# EAGLE design at88g.v2 (EAGLE 4.11)
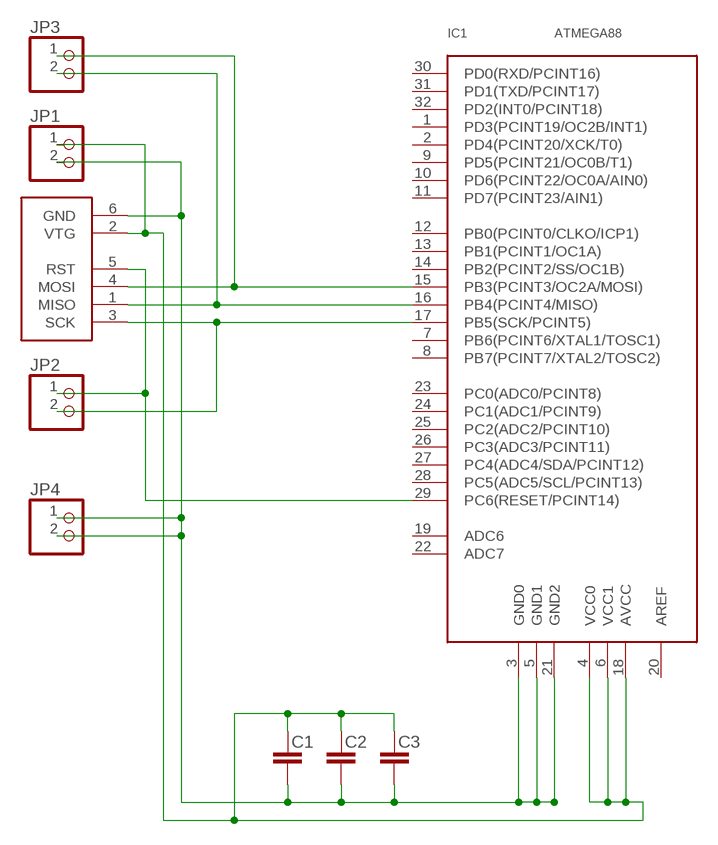
[diagram p0: schematic, sheet 1]

## Parts
C1  C-EU  [C0603]
C2  C-EU  [C0603]
C3  C-EU  [C0603]
IC1  ATMEGA88  [TQFP32]
JP1  PINHD-1X2  [1X02]
JP2  PINHD-1X2  [1X02]
JP3  PINHD-1X2  [1X02]
JP4  PINHD-1X2  [1X02]
X1  AVRISP6PIN  [6PIN]

## Nets
GND0: C1.2 C2.2 C3.2 IC1.3(GND0) IC1.5(GND1) IC1.21(GND2) JP1.2 JP4.1 JP4.2 X1.6(GND)
N$1: IC1.29(PC6(RESET/PCINT14)) JP2.1 X1.5(RST)
N$2: IC1.15(PB3(PCINT3/OC2A/MOSI)) JP3.1 X1.4(MOSI)
N$3: IC1.16(PB4(PCINT4/MISO)) JP3.2 X1.1(MISO)
N$4: IC1.17(PB5(SCK/PCINT5)) JP2.2 X1.3(SCK)
VCC0: C1.1 C2.1 C3.1 IC1.4(VCC0) IC1.6(VCC1) IC1.18(AVCC) JP1.1 X1.2(VTG)
Unconnected: IC1.1(PD3(PCINT19/OC2B/INT1)) IC1.2(PD4(PCINT20/XCK/T0)) IC1.7(PB6(PCINT6/XTAL1/TOSC1)) IC1.8(PB7(PCINT7/XTAL2/TOSC2)) IC1.9(PD5(PCINT21/OC0B/T1)) IC1.10(PD6(PCINT22/OC0A/AIN0)) IC1.11(PD7(PCINT23/AIN1)) IC1.12(PB0(PCINT0/CLKO/ICP1)) IC1.13(PB1(PCINT1/OC1A)) IC1.14(PB2(PCINT2/SS/OC1B)) IC1.19(ADC6) IC1.20(AREF) IC1.22(ADC7) IC1.23(PC0(ADC0/PCINT8)) IC1.24(PC1(ADC1/PCINT9)) IC1.25(PC2(ADC2/PCINT10)) IC1.26(PC3(ADC3/PCINT11)) IC1.27(PC4(ADC4/SDA/PCINT12)) IC1.28(PC5(ADC5/SCL/PCINT13)) IC1.30(PD0(RXD/PCINT16)) IC1.31(PD1(TXD/PCINT17)) IC1.32(PD2(INT0/PCINT18))

## Library data of the parts
C1-C3 = rcl:C-EU
IC1 = atmega88:ATMEGA88
JP1-JP4 = pinhead-mm:PINHD-1X2: PIN HEADER
X1 = avrisp:AVRISP6PIN

## Board
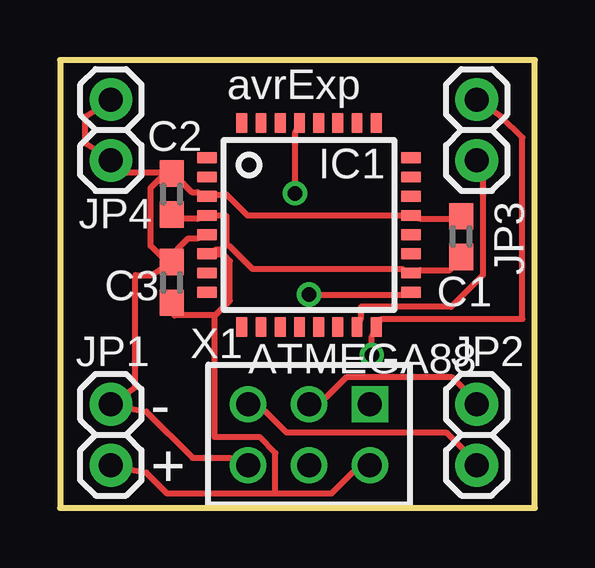
[diagram p1: board, top side]
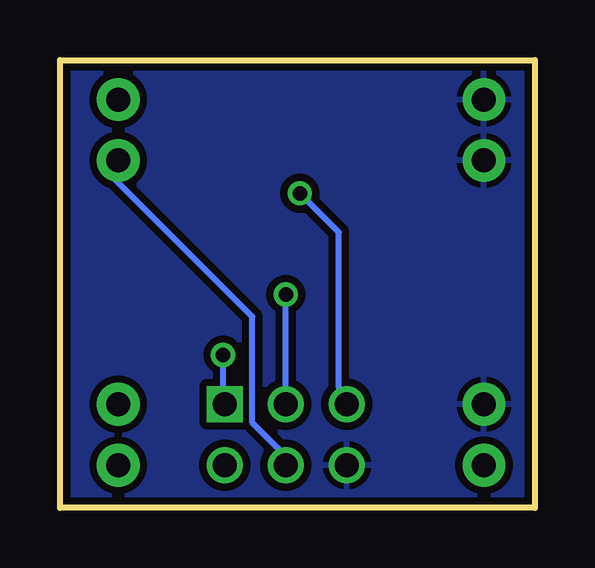
[diagram p2: board, bottom side, seen from below]

Size 19.79 x 18.66 mm. Coordinates in mm from the lower left corner, seen from the top.
Outline: 0,0 19.79,0 19.79,18.66 0,18.66 0,0
Copper layers (1*16): Top 0.035mm / dielectric 1.5mm / Bottom 0.035mm
Design rules "default": minimum track width 10mil, minimum drill 0.6mm, track to track 10mil, track to pad 10mil, pad to pad 10mil, via to via 10mil, smd to smd 10mil, copper to edge 10mil, drill to drill 10mil, minimum pad ring 10mil, minimum via ring 8mil, stop-mask expansion 4mil, vias tented up to drill 0mil, thermal gap 10mil

### Footprints (pad centres in the part's own frame; a part is rotated, then mirrored left to right if it is on the bottom)
C0603 = smd 1.1 x 1: 1 -0.85,0; 2 0.85,0
TQFP32 = smd 0.8 x 0.45: 1 -4.25,2.65; 2 -4.25,1.85; 3 -4.25,1.05; 4 -4.25,0.25; 5 -4.25,-0.55; 6 -4.25,-1.35; 7 -4.25,-2.15; 8 -4.25,-2.95; 17 4.25,-2.95; 18 4.25,-2.15; 19 4.25,-1.35; 20 4.25,-0.55; 21 4.25,0.25; 22 4.25,1.05; 23 4.25,1.85; 24 4.25,2.65 | smd 0.45 x 0.8: 9 -2.8,-4.4; 10 -2,-4.4; 11 -1.2,-4.4; 12 -0.4,-4.4; 13 0.4,-4.4; 14 1.2,-4.4; 15 2,-4.4; 16 2.8,-4.4; 25 2.8,4.1; 26 2,4.1; 27 1.2,4.1; 28 0.4,4.1; 29 -0.4,4.1; 30 -1.2,4.1; 31 -2,4.1; 32 -2.8,4.1
1X02 = drill 1 pad 1.778 round: 1 -1.27,0; 2 1.27,0
6PIN = drill 1 square: 1 -1.27,2.54 | drill 1 round: 2 1.27,2.54; 3 -1.27,0; 4 1.27,0; 5 -1.27,-2.54; 6 1.27,-2.54

### Placement (x,y rotation side)
C1  16.73,11.3 90 top
C2  4.66,13.08 90 top
C3  4.66,9.39 90 top
IC1  10.38,11.93 0 top
JP1  2.12,3.04 90 top
JP2  17.36,3.04 90 top
JP3  17.36,15.74 90 top
JP4  2.12,15.74 90 top
X1  10.38,3.04 270 top

### Tracks (layer width: path | path; a pad name or v marks a point on that pad's centre or on a via)
GND0
  Top 0.254: X1.6 7.1,2.08 5.53,2.08 3.59,4.01 JP1.2 3.14,5.02 3.14,9.7 3.8,9.7 C3.2 | JP4.2 1.05,16.3 1.05,15.18 JP4.1 2.64,13.96 4.41,13.96 | IC1.5 5.73,11.22 5.35,11.22 4.89,10.77 C3.2 | C1.2 16.24,12.03 15.02,12.03 IC1.21 14.26,12.19 7.81,12.19 6.95,13.05 6.24,13.05 IC1.3 5.73,13.15 5.5,13.15 5.14,13.51 C2.2 4.41,13.96 | C3.2 4.45,10.24 3.77,10.92 3.77,13.33 4.41,13.96 | 4.41,13.96 4.41,13.97 | 4.41,13.96
  pour Bottom (isolate 0.305): -0.16,18.79 19.9,18.79 19.9,-0.13 -0.16,-0.13
N$1  (via drill 0.6)
  Top 0.254: v9.79,13.1 9.79,15.64 IC1.29 | JP2.1 17.16,2.08 16.09,3.14 9.44,3.14 8.57,4.01 X1.5
  Bottom 0.254: v9.79,13.1 8.17,11.48 8.17,5.02 X1.5
N$2
  Top 0.254: IC1.15 12.54,7.92 12.54,8.38 16.29,8.38 17.61,9.7 17.61,13.76 JP3.1
  Bottom 0.254: X1.4 10.71,2.48 11.77,3.55 11.77,7.97 17.56,13.76 JP3.1
N$3  (via drill 0.6)
  Top 0.254: v12.99,6.37 12.99,7.16 IC1.16 13.4,7.87 19.27,7.87 19.27,15.44 18.38,16.3 JP3.2
  Bottom 0.254: v12.99,6.37 12.99,5.02 X1.1
N$4  (via drill 0.6)
  Top 0.254: IC1.17 14.26,8.89 v10.38,8.89 | JP2.2 17.16,4.62 16.32,5.46 11.95,5.46 11.11,4.62 X1.3
  Bottom 0.254: X1.3 v10.38,8.89
VCC0
  Top 0.254: C1.1 16.24,9.9 15.02,9.9 IC1.18 14.26,9.95 8.01,9.95 7.05,10.92 6.95,10.97 | 6.95,10.97 6.74,10.77 6.49,10.77 IC1.6 6.19,10.54 6.82,10.54 7.07,10.28 7.07,8.63 6.44,8 | 6.95,10.97 6.95,12.16 6.49,12.16 IC1.4 5.73,12.03 4.51,12.03 C2.1 | 4.64,8.58 C3.1 4.76,8.02 6.44,8.02 6.44,8 | 8.98,0.6 11.32,0.6 12.18,1.47 X1.2 | 8.98,0.6 4.46,0.6 3.59,1.47 JP1.1 | 6.44,8 6.44,2.94 8.32,2.94 8.98,2.28 8.98,0.6

### Text on the board
tNames: avrExp | - | +